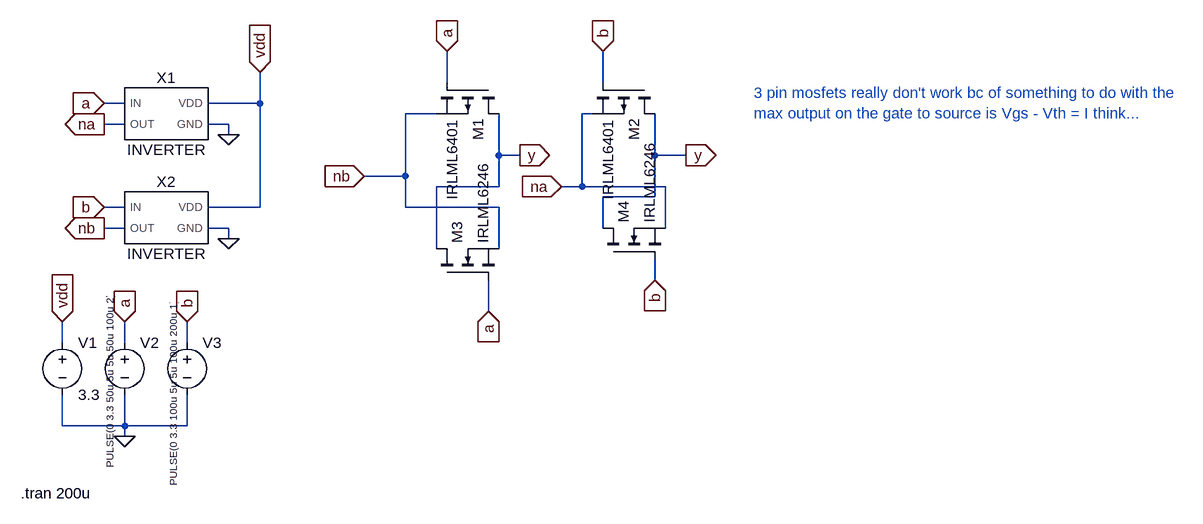
[diagram p0: schematic xor_tg_raw.asc]
xor_tg_raw.asc, the LTspice schematic file:
Version 4.1
SHEET 1 2096 696
WIRE 480 48 480 0
WIRE 720 48 720 0
WIRE -16 80 -48 80
WIRE 192 80 192 32
WIRE 192 80 112 80
WIRE 464 96 416 96
WIRE 704 96 688 96
WIRE -16 112 -48 112
WIRE 144 112 112 112
WIRE 144 128 144 112
WIRE 560 160 560 96
WIRE 592 160 560 160
WIRE 800 160 800 96
WIRE 848 160 800 160
WIRE 416 192 416 96
WIRE 416 192 352 192
WIRE 560 208 560 160
WIRE 560 208 464 208
WIRE 688 208 688 96
WIRE 688 208 656 208
WIRE 816 208 688 208
WIRE 800 224 800 160
WIRE 800 224 720 224
WIRE -16 240 -48 240
WIRE 192 240 192 80
WIRE 192 240 112 240
WIRE 416 240 416 192
WIRE 560 240 416 240
WIRE -16 272 -48 272
WIRE 144 272 112 272
WIRE 720 272 720 224
WIRE 816 272 816 208
WIRE 144 288 144 272
WIRE 464 304 464 208
WIRE 560 304 560 240
WIRE 800 352 800 320
WIRE 544 400 544 352
WIRE -112 448 -112 416
WIRE -16 448 -16 416
WIRE 80 448 80 416
WIRE -112 576 -112 528
WIRE -16 576 -16 528
WIRE -16 576 -112 576
WIRE 80 576 80 528
WIRE 80 576 -16 576
WIRE -16 592 -16 576
FLAG -48 80 a
IOPIN -48 80 In
FLAG -48 112 na
IOPIN -48 112 Out
FLAG 144 128 0
FLAG 144 288 0
FLAG -48 240 b
IOPIN -48 240 In
FLAG -48 272 nb
IOPIN -48 272 Out
FLAG -16 592 0
FLAG -112 416 vdd
IOPIN -112 416 In
FLAG -16 416 a
IOPIN -16 416 In
FLAG 80 416 b
IOPIN 80 416 In
FLAG 192 32 vdd
IOPIN 192 32 In
FLAG 544 400 a
IOPIN 544 400 In
FLAG 480 0 a
IOPIN 480 0 In
FLAG 592 160 y
IOPIN 592 160 Out
FLAG 352 192 nb
IOPIN 352 192 In
FLAG 720 0 b
IOPIN 720 0 In
FLAG 800 352 b
IOPIN 800 352 In
FLAG 848 160 y
IOPIN 848 160 Out
FLAG 656 208 na
IOPIN 656 208 In
SYMBOL inverter 48 96 R0
SYMATTR InstName X1
SYMATTR SpiceModel ""
SYMBOL inverter 48 256 R0
SYMATTR InstName X2
SYMATTR SpiceModel ""
SYMBOL voltage -112 432 R0
WINDOW 123 0 0 Left 0
WINDOW 39 0 0 Left 0
SYMATTR InstName V1
SYMATTR Value 3.3
SYMBOL voltage -16 432 R0
WINDOW 3 -23 209 VLeft 1
WINDOW 123 0 0 Left 0
WINDOW 39 0 0 Left 0
SYMATTR Value PULSE(0 3.3 50u 5u 5u 50u 100u 2)
SYMATTR InstName V2
SYMBOL voltage 80 432 R0
WINDOW 3 -21 237 VLeft 1
WINDOW 123 0 0 Left 0
WINDOW 39 0 0 Left 0
SYMATTR Value PULSE(0 3.3 100u 5u 5u 100u 200u 1)
SYMATTR InstName V3
SYMBOL pmos 560 48 R90
SYMATTR InstName M1
SYMATTR Value IRLML6401
SYMBOL pmos 800 48 R90
SYMATTR InstName M2
SYMATTR Value IRLML6401
SYMBOL nmos 464 352 R270
SYMATTR InstName M3
SYMATTR Value IRLML6246
SYMBOL nmos 720 320 R270
SYMATTR InstName M4
SYMATTR Value IRLML6246
TEXT -176 680 Left 2 !.tran 200u
TEXT 952 64 Left 2 ;3 pin mosfets really don't work bc of something to do with the \nmax output on the gate to source is Vgs - Vth = I think...

The netlist it stands for:
* xor_tg_raw.asc
X§X1 a na vdd 0 INVERTER  ; pins IN OUT VDD GND
X§X2 b nb vdd 0 INVERTER  ; pins IN OUT VDD GND
V1 vdd 0 3.3
V2 a 0 PULSE(0 3.3 50u 5u 5u 50u 100u 2)
V3 b 0 PULSE(0 3.3 100u 5u 5u 100u 200u 1)
M1 y a nb nb IRLML6401
M2 y b na na IRLML6401
M3 y a nb nb IRLML6246
M4 y b na na IRLML6246
.model NMOS NMOS
.model PMOS PMOS
.lib standard.mos
.tran 200u
* 3 pin mosfets really don't work bc of something to do with the
* max output on the gate to source is Vgs - Vth = I think...
.lib yap_cells.lib
.backanno
.end